# EAGLE design StepperDriver_RevA (EAGLE 7.6.0)
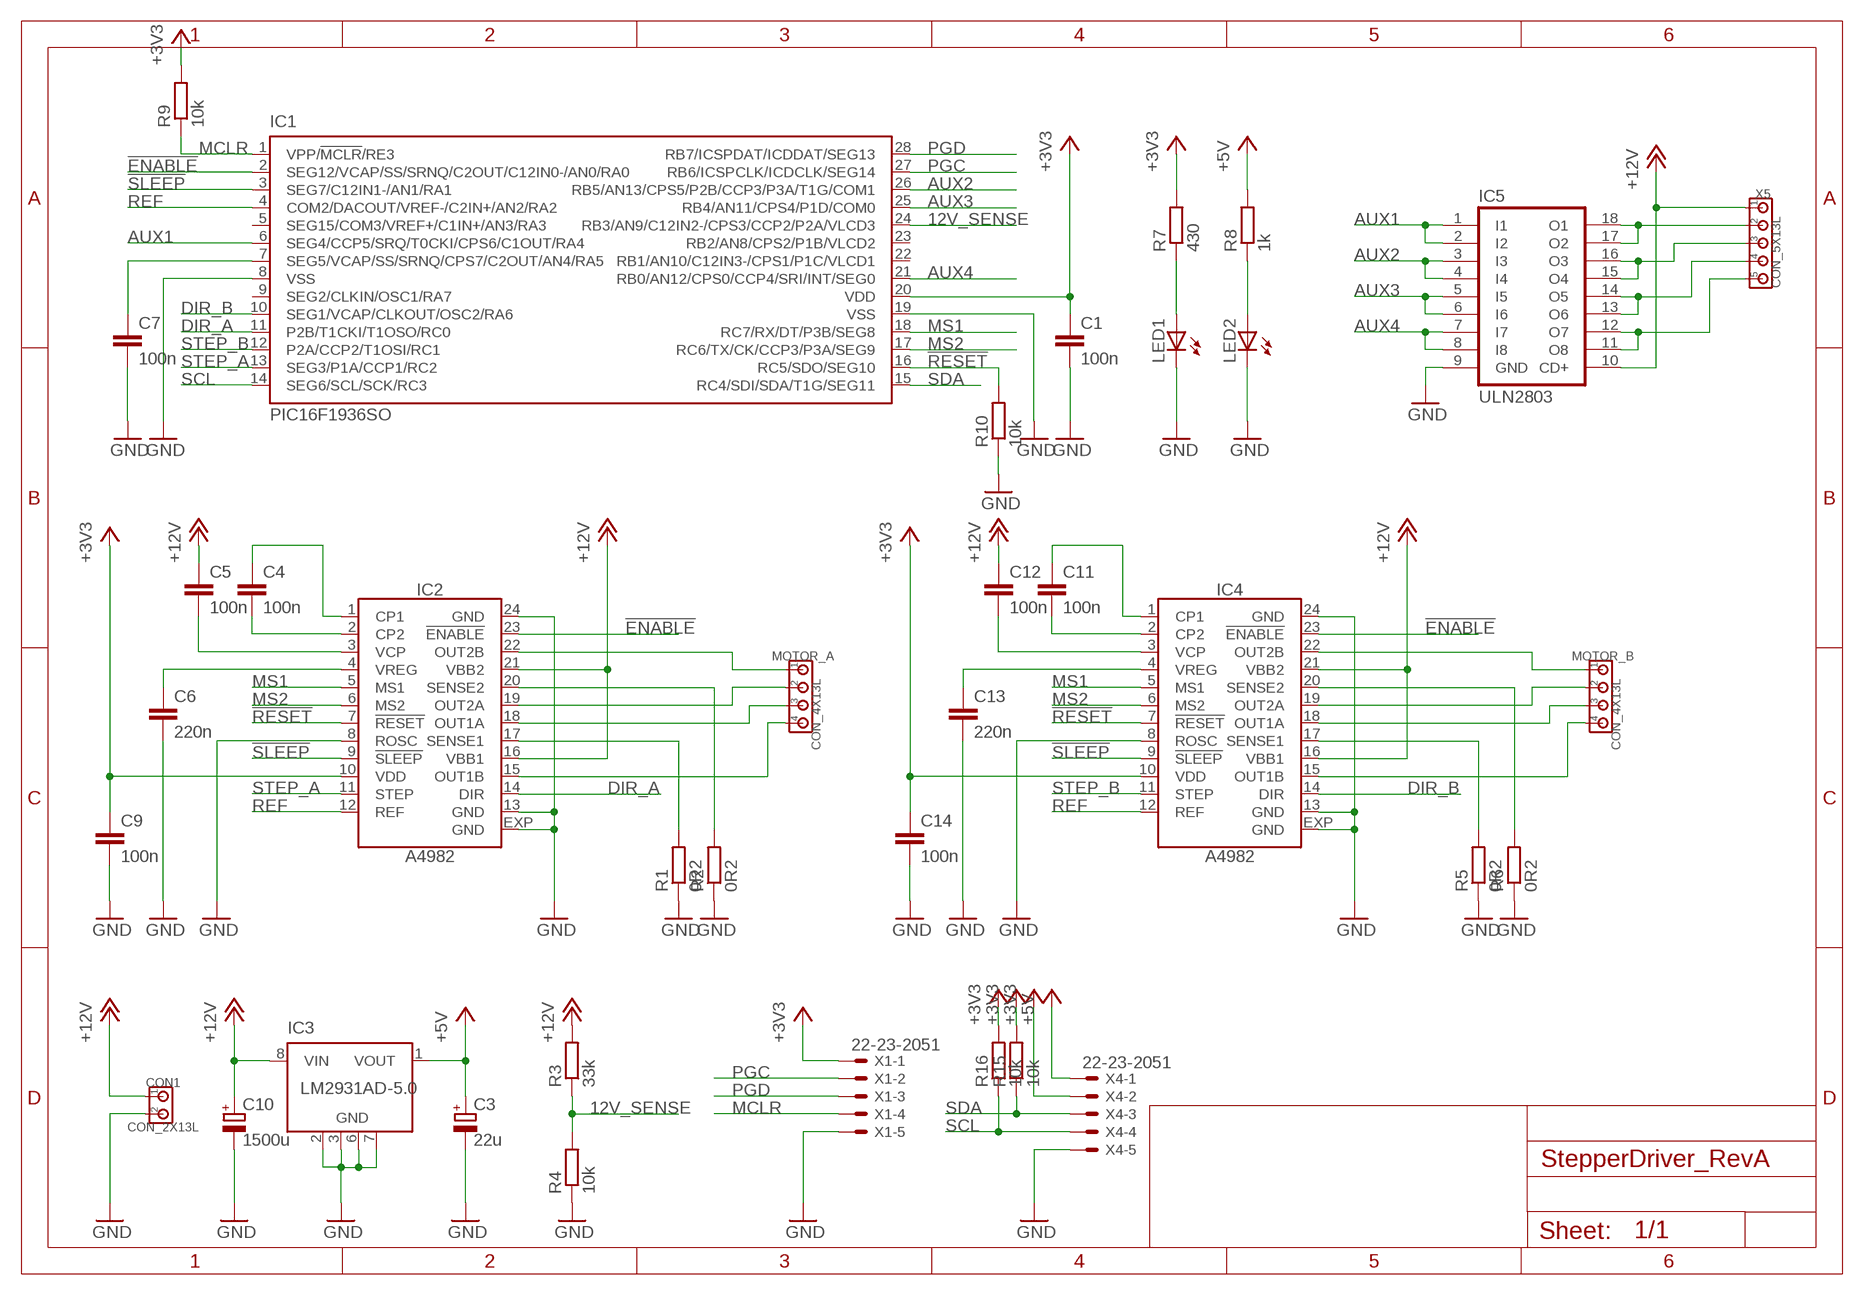
[diagram p0: schematic, sheet 1]

## Parts
C1  100n  CC0805  [C0805]
C3  22u  C_POLARIZEDSMC_C  [SMC_C]
C4  100n  CC0805  [C0805]
C5  100n  CC0805  [C0805]
C6  220n  CC0805  [C0805]
C7  100n  CC0805  [C0805]
C9  100n  CC0805  [C0805]
C10  1500u  C_POLARIZED10MM  [10MM]
C11  100n  CC0805  [C0805]
C12  100n  CC0805  [C0805]
C13  220n  CC0805  [C0805]
C14  100n  CC0805  [C0805]
CON1  CON_2X13L  [200MIL_2X]
IC1  PIC16F1936SO  [SO28W]
IC2  A4982  [TSSOP-24_LP]
IC3  LM2931AD-5.0  [SO8]
IC4  A4982  [TSSOP-24_LP]
IC5  ULN2803  [SO18W]
LED1  LED0805  [LED0805]
LED2  LED0805  [LED0805]
MOTOR_A  CON_4X13L  [200MIL_4X]
MOTOR_B  CON_4X13L  [200MIL_4X]
R1  0R2  RESISTOR0612  [0612]
R2  0R2  RESISTOR0612  [0612]
R3  33k  RESISTORR0805  [R0805]
R4  10k  RESISTORR0805  [R0805]
R5  0R2  RESISTOR0612  [0612]
R6  0R2  RESISTOR0612  [0612]
R7  430  RESISTORR0805  [R0805]
R8  1k  RESISTORR0805  [R0805]
R9  10k  RESISTORR0805  [R0805]
R10  10k  RESISTORR0805  [R0805]
R15  10k  RESISTORR0805  [R0805]
R16  10k  RESISTORR0805  [R0805]
X1  22-23-2051  [22-23-2051]
X4  22-23-2051  [22-23-2051]
X5  CON_5X13L  [200MIL_5X]

## Nets
12V_SENSE: IC1.24(RB3/AN9/C12IN2-/CPS3/CCP2/P2A/VLCD3) R3.1 R4.2
!ENABLE!: IC1.2(SEG12/VCAP/SS/SRNQ/C2OUT/C12IN0-/AN0/RA0) IC2.23(!ENABLE!) IC4.23(!ENABLE!)
!RESET!: IC1.16(RC5/SDO/SEG10) IC2.7(!RESET!) IC4.7(!RESET!) R10.2
!SLEEP!: IC1.3(SEG7/C12IN1-/AN1/RA1) IC2.9(!SLEEP!) IC4.9(!SLEEP!)
+3V3: C1.1 C9.1 C14.1 IC1.20(VDD) IC2.10(VDD) IC4.10(VDD) R7.2 R9.2 R15.2 R16.2 X1.1 X4.2
+5V: C3.+ IC3.1(VOUT) R8.2 X4.1
+12V: C5.1 C10.+ C12.1 CON1.1 IC2.16(VBB1) IC2.21(VBB2) IC3.8(VIN) IC4.16(VBB1) IC4.21(VBB2) IC5.10(CD+) R3.2 X5.1
AUX1: IC1.6(SEG4/CCP5/SRQ/T0CKI/CPS6/C1OUT/RA4) IC5.1(I1) IC5.2(I2)
AUX2: IC1.26(RB5/AN13/CPS5/P2B/CCP3/P3A/T1G/COM1) IC5.3(I3) IC5.4(I4)
AUX3: IC1.25(RB4/AN11/CPS4/P1D/COM0) IC5.5(I5) IC5.6(I6)
AUX4: IC1.21(RB0/AN12/CPS0/CCP4/SRI/INT/SEG0) IC5.7(I7) IC5.8(I8)
DIR_A: IC1.11(P2B/T1CKI/T1OSO/RC0) IC2.14(DIR)
DIR_B: IC1.10(SEG1/VCAP/CLKOUT/OSC2/RA6) IC4.14(DIR)
GND: C1.2 C3.- C6.2 C7.2 C9.2 C10.- C13.2 C14.2 CON1.2 IC1.8(VSS) IC1.19(VSS) IC2.8(ROSC) IC2.13(GND) IC2.24(GND) IC2.EXP(GND) IC3.2(GND) IC3.3(GND) IC3.6(GND) IC3.7(GND) IC4.8(ROSC) IC4.13(GND) IC4.24(GND) IC4.EXP(GND) IC5.9(GND) LED1.C LED2.C R1.1 R2.1 R4.1 R5.1 R6.1 R10.1 X1.5 X4.5
MCLR: IC1.1(VPP/!MCLR!/RE3) R9.1 X1.4
MS1: IC1.18(RC7/RX/DT/P3B/SEG8) IC2.5(MS1) IC4.5(MS1)
MS2: IC1.17(RC6/TX/CK/CCP3/P3A/SEG9) IC2.6(MS2) IC4.6(MS2)
N$1: LED1.A R7.1
N$2: LED2.A R8.1
N$5: C7.1 IC1.7(SEG5/VCAP/SS/SRNQ/CPS7/C2OUT/AN4/RA5)
N$6: IC2.22(OUT2B) MOTOR_A.1
N$11: IC2.19(OUT2A) MOTOR_A.2
N$13: IC2.18(OUT1A) MOTOR_A.3
N$14: C4.2 IC2.2(CP2)
N$15: IC2.15(OUT1B) MOTOR_A.4
N$16: C4.1 IC2.1(CP1)
N$17: C5.2 IC2.3(VCP)
N$18: C6.1 IC2.4(VREG)
N$22: IC2.20(SENSE2) R2.2
N$23: IC2.17(SENSE1) R1.2
N$24: IC4.22(OUT2B) MOTOR_B.1
N$25: IC4.19(OUT2A) MOTOR_B.2
N$26: IC4.18(OUT1A) MOTOR_B.3
N$27: IC4.15(OUT1B) MOTOR_B.4
N$28: C11.2 IC4.2(CP2)
N$29: C11.1 IC4.1(CP1)
N$30: C12.2 IC4.3(VCP)
N$31: C13.1 IC4.4(VREG)
N$32: IC4.20(SENSE2) R6.2
N$33: IC4.17(SENSE1) R5.2
N$34: IC5.17(O2) IC5.18(O1) X5.2
N$35: IC5.15(O4) IC5.16(O3) X5.3
N$36: IC5.13(O6) IC5.14(O5) X5.4
N$37: IC5.11(O8) IC5.12(O7) X5.5
PGC: IC1.27(RB6/ICSPCLK/ICDCLK/SEG14) X1.2
PGD: IC1.28(RB7/ICSPDAT/ICDDAT/SEG13) X1.3
REF: IC1.4(COM2/DACOUT/VREF-/C2IN+/AN2/RA2) IC2.12(REF) IC4.12(REF)
SCL: IC1.14(SEG6/SCL/SCK/RC3) R16.1 X4.4
SDA: IC1.15(RC4/SDI/SDA/T1G/SEG11) R15.1 X4.3
STEP_A: IC1.13(SEG3/P1A/CCP1/RC2) IC2.11(STEP)
STEP_B: IC1.12(P2A/CCP2/T1OSI/RC1) IC4.11(STEP)
Unconnected: IC1.5(SEG15/COM3/VREF+/C1IN+/AN3/RA3) IC1.9(SEG2/CLKIN/OSC1/RA7) IC1.22(RB1/AN10/C12IN3-/CPS1/P1C/VLCD1) IC1.23(RB2/AN8/CPS2/P1B/VLCD2)

## Library data of the parts
C1 C4-C7 C9 C11-C14 = 00Capacitor:C: Capacitor
C3 C10 = 00Capacitor:C_POLARIZED
CON1 = 00Connector:CON_2X: 2-pin header
IC1 = 00PIC:PIC16F19*: Flash-Based, 8-Bit CMOS Microcontroller; EEPROM: 256; FLASH: 8192; RAM: 512
IC2 IC4 = 00Logic:A4982
IC3 = 00VoltageRegulator:LM2931*
IC5 = 00Mosfet:ULN2803
LED1 LED2 = 00Display:LED: LED
MOTOR_A MOTOR_B = 00Connector:CON_4X: 4-pin header
R1-R10 R15 R16 = 00Resistor:RESISTOR: RESISTOR, European symbol
X1 X4 = 00Connector:22-23-2051: .100" (2.54mm) Center Header - 5 Pin; MF: MOLEX; MPN: 22-23-2051; OC_FARNELL: 1462952; OC_NEWARK: 38C9178
X5 = 00Connector:CON_5X: 5-pin header

## Board
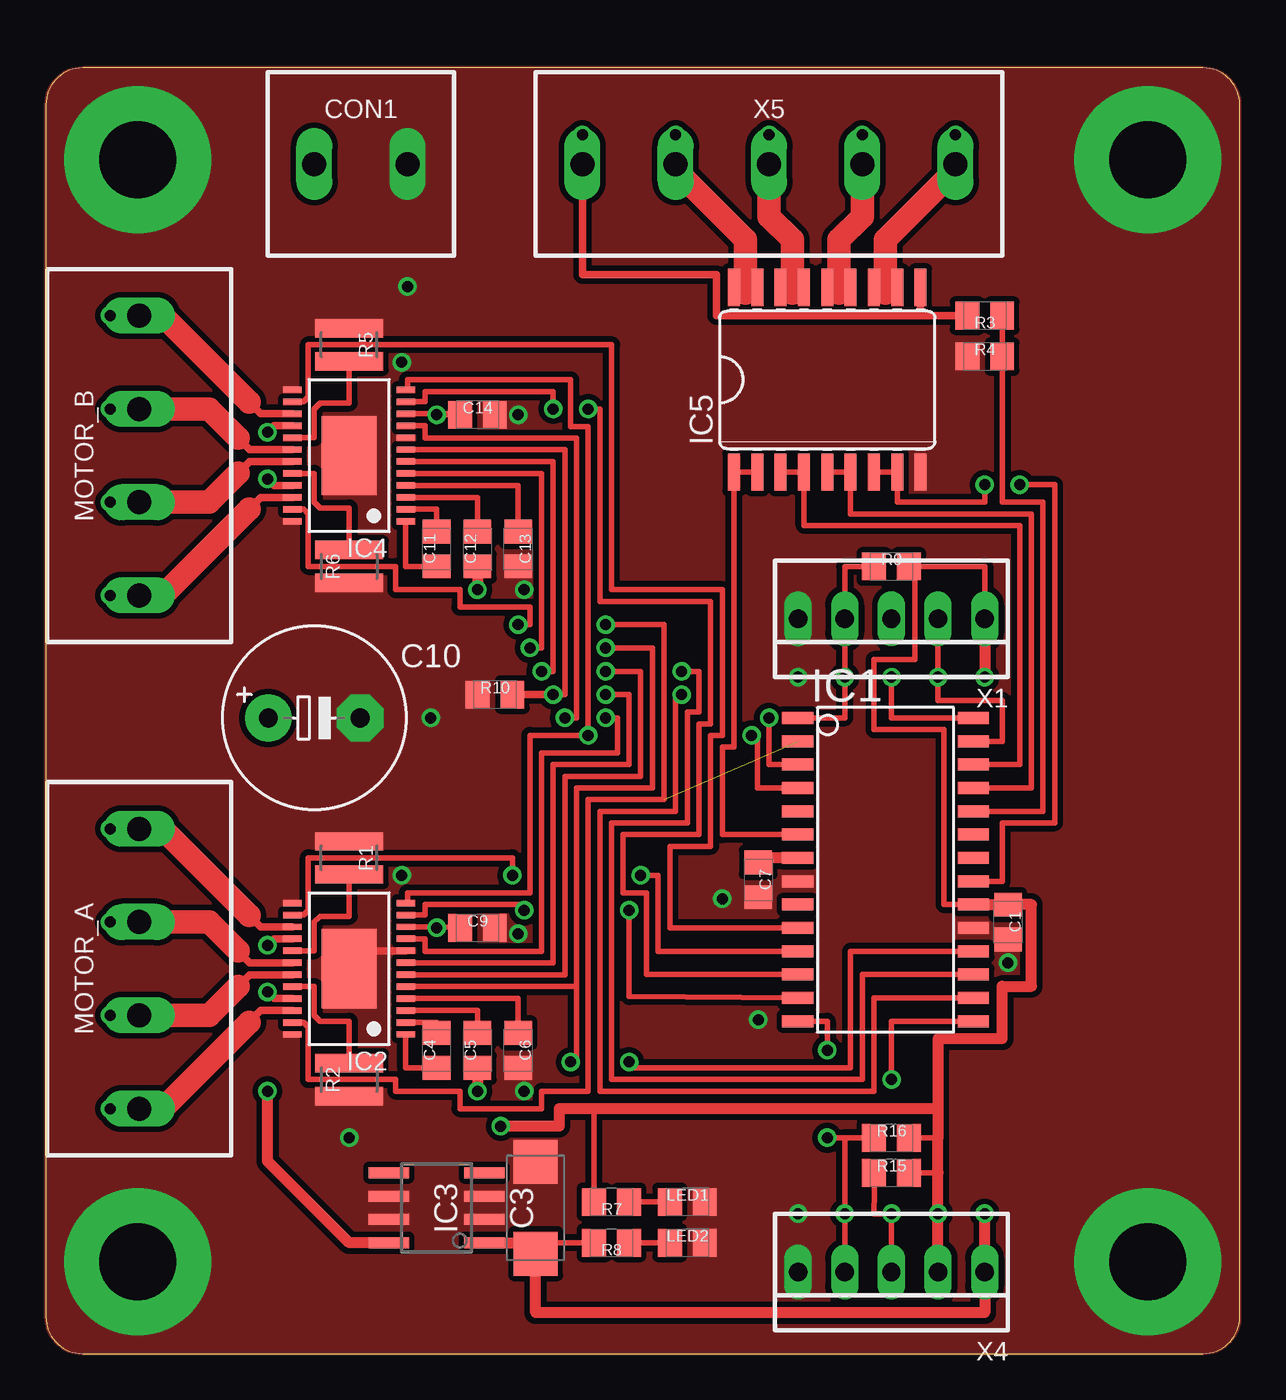
[diagram p1: board, top side]
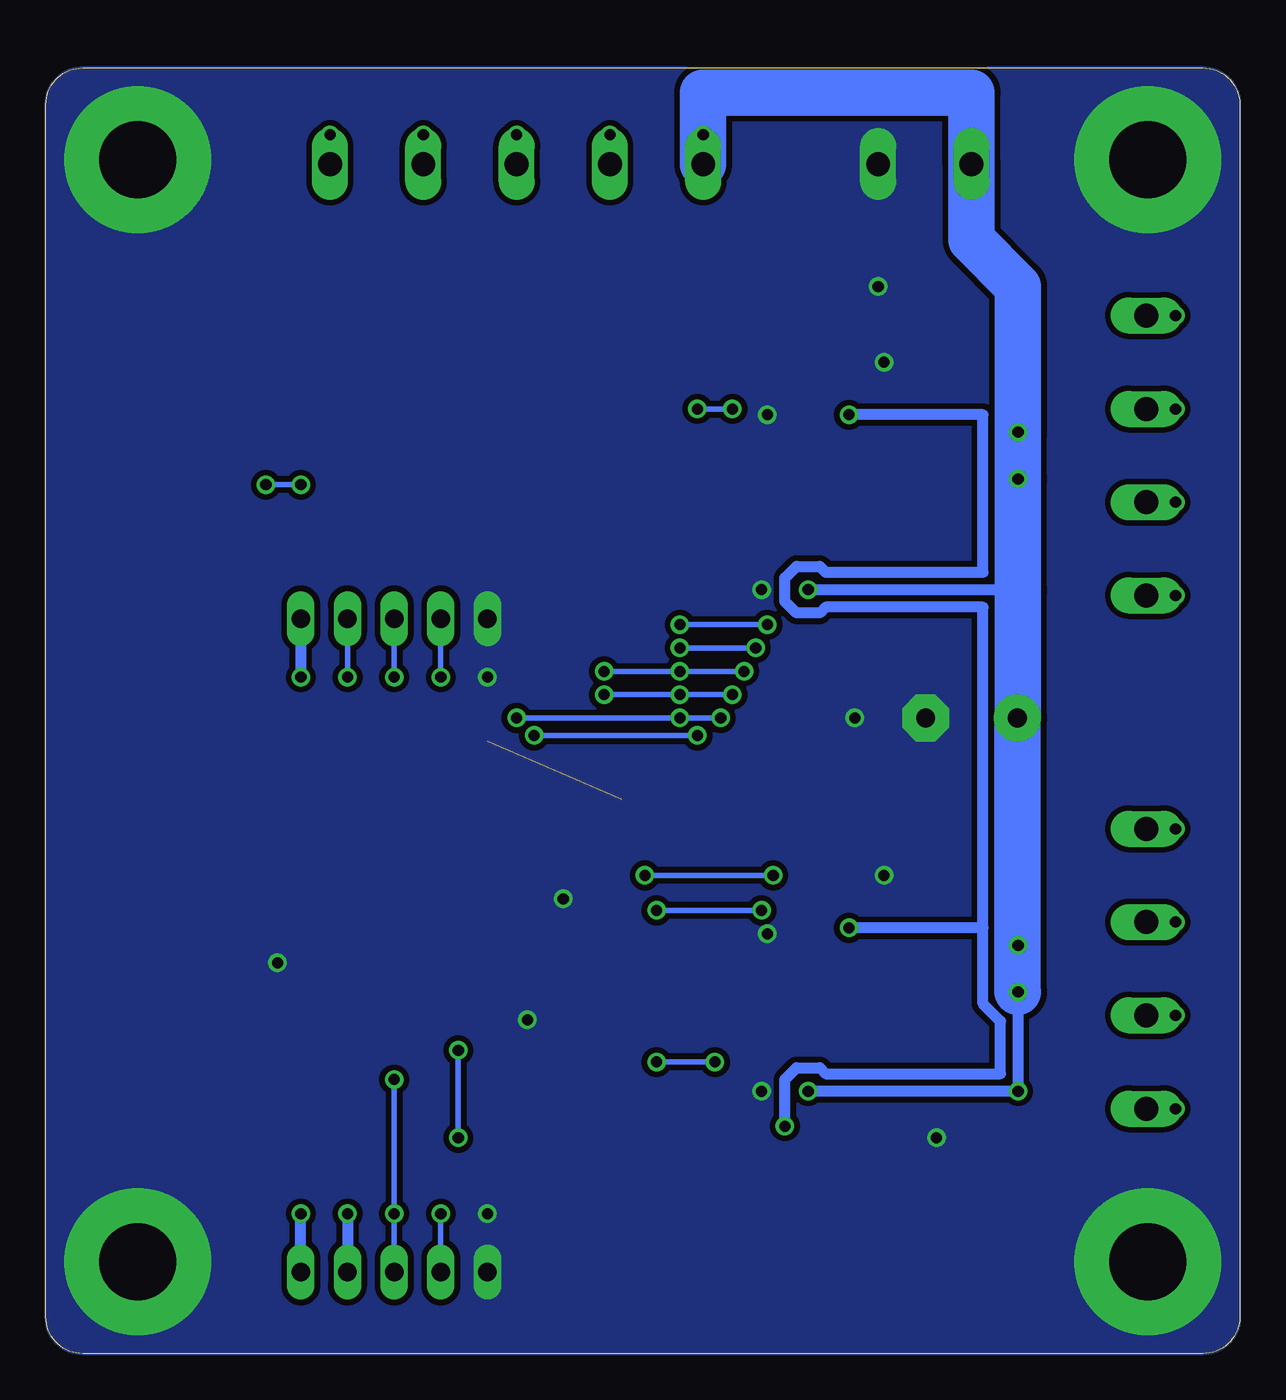
[diagram p2: board, bottom side, seen from below]

Size 65 x 70 mm. Coordinates in mm from the lower left corner, seen from the top.
Outline: 63,0 arc90 65,2 65,68 arc90 63,70 2,70 arc90 0,68 0,2 arc90 2,0 63,0
Copper layers (1*16): Top 0.035mm / dielectric 1.5mm / Bottom 0.035mm
Design rules "default *": minimum track width 10mil, minimum drill 0.6mm, track to track 8mil, track to pad 8mil, pad to pad 8mil, via to via 8mil, smd to smd 8mil, copper to edge 0mil, drill to drill 8mil, minimum pad ring 10mil, minimum via ring 8mil, stop-mask expansion 4mil, vias tented up to drill 0mil, thermal gap 10mil

### Footprints (pad centres in the part's own frame; a part is rotated, then mirrored left to right if it is on the bottom)
C0805 = smd 1.3 x 1.5: 1 -0.95,0; 2 0.95,0
SMC_C = smd 2.4 x 2.4: + -2.5,0; - 2.5,0
10MM = drill 1.016 pad 2.54: + -2.5,0 | drill 1.016 pad 2.54 octagon: - 2.5,0
200MIL_2X = drill 1.3 long: 1 -2.54,0; 2 2.54,0
SO28W = smd 0.65 x 1.7: 1 -7.62,-4.78; 2 -6.35,-4.78; 3 -5.08,-4.78; 4 -3.81,-4.78; 5 -2.54,-4.78; 6 -1.27,-4.78; 7 0,-4.78; 8 1.27,-4.78; 9 2.54,-4.78; 10 3.81,-4.78; 11 5.08,-4.78; 12 6.35,-4.78; 13 7.62,-4.78; 14 8.89,-4.78; 15 8.89,4.78; 16 7.62,4.78; 17 6.35,4.78; 18 5.08,4.78; 19 3.81,4.78; 20 2.54,4.78; 21 1.27,4.78; 22 0,4.78; 23 -1.27,4.78; 24 -2.54,4.78; 25 -3.81,4.78; 26 -5.08,4.78; 27 -6.35,4.78; 28 -7.62,4.78
TSSOP-24_LP = smd 0.35 x 1: 1 -3.575,-3.087; 2 -2.925,-3.087; 3 -2.275,-3.087; 4 -1.625,-3.087; 5 -0.975,-3.087; 6 -0.325,-3.087; 7 0.325,-3.087; 8 0.975,-3.087; 9 1.625,-3.087; 10 2.275,-3.087; 11 2.925,-3.087; 12 3.575,-3.087; 13 3.575,3.087; 14 2.925,3.087; 15 2.275,3.087; 16 1.625,3.087; 17 0.975,3.087; 18 0.325,3.087; 19 -0.325,3.087; 20 -0.975,3.087; 21 -1.625,3.087; 22 -2.275,3.087; 23 -2.925,3.087; 24 -3.575,3.087 | smd 4.32 x 3: EXP 0,0
SO8 = smd 2.2 x 0.6: 1 -2.6,1.905; 2 -2.6,0.635; 3 -2.6,-0.635; 4 -2.6,-1.905; 5 2.6,-1.905; 6 2.6,-0.635; 7 2.6,0.635; 8 2.6,1.905
SO18W = smd 0.66 x 2.032: 1 -5.08,-5.029; 2 -3.81,-5.029; 3 -2.54,-5.029; 4 -1.27,-5.029; 5 0,-5.029; 6 1.27,-5.029; 7 2.54,-5.029; 8 3.81,-5.029; 9 5.08,-5.029; 10 5.08,5.029; 11 3.81,5.029; 12 2.54,5.029; 13 1.27,5.029; 14 0,5.029; 15 -1.27,5.029; 16 -2.54,5.029; 17 -3.81,5.029; 18 -5.08,5.029
LED0805 = smd 1.3 x 1.5: A -0.95,0; C 0.95,0
200MIL_4X = drill 1.3 long: 1 -7.62,0; 2 -2.54,0; 3 2.54,0; 4 7.62,0
0612 = smd 1 x 3.7: 1 -0.9,0; 2 0.9,0
R0805 = smd 1.3 x 1.5: 1 -0.95,0; 2 0.95,0
22-23-2051 = drill 1 long: 1 -5.08,0; 2 -2.54,0; 3 0,0; 4 2.54,0; 5 5.08,0
200MIL_5X = drill 1.3 long: 1 -10.16,0; 2 -5.08,0; 3 0,0; 4 5.08,0; 5 10.16,0

### Placement (x,y rotation side)
C1  52.39,23.5 270 top
C3  26.67,7.94 90 top
C4  21.27,16.51 90 top
C5  23.5,16.51 90 top
C6  25.72,16.51 270 top
C7  38.78,25.8 270 top
C9  23.5,23.18 0 top
C10  14.61,34.61 0 top
C11  21.27,43.81 90 top
C12  23.5,43.81 90 top
C13  25.72,43.81 270 top
C14  23.5,51.12 0 top
CON1  17.14,64.77 0 top
IC1  45.72,26.99 270 top
IC2  16.51,20.95 90 top
IC3  21.27,7.94 180 top
IC4  16.51,48.9 90 top
IC5  42.55,53.02 0 top
LED1  34.92,8.26 0 top
LED2  34.92,6.03 0 top
MOTOR_A  5.08,20.95 90 top
MOTOR_B  5.08,48.9 90 top
R1  16.51,26.99 270 top
R2  16.51,14.92 90 top
R3  51.12,56.52 180 top
R4  51.12,54.29 0 top
R5  16.51,54.93 270 top
R6  16.51,42.86 90 top
R7  30.8,8.26 180 top
R8  30.8,6.03 180 top
R9  46.04,42.86 0 top
R10  24.45,35.88 0 top
R15  46.04,9.84 0 top
R16  46.04,11.75 0 top
X1  46.04,40.01 180 top
X4  46.04,4.45 180 top
X5  39.37,64.77 0 top

### Tracks (layer width: path | path; a pad name or v marks a point on that pad's centre or on a via)
12V_SENSE
  Top 0.305: R3.1 R4.2 52.07,46.35 54.29,46.35 54.29,29.53 IC1.24
!ENABLE!  (via drill 0.6)  (1 unrouted)
  Top 0.305: IC2.23 14.04,18.03 14.29,17.78 14.29,14.92 19.05,14.92 19.05,14.29 22.54,14.29 22.54,13.34 26.99,13.34 26.99,14.29 29.53,14.29 29.53,30.16 33.66,30.16 33.66,39.69 v30.48,39.69 | IC4.23 14.04,45.97 14.29,45.72 14.29,42.86 19.05,42.86 19.05,41.59 22.54,41.59 22.54,40.64 26.35,40.64 26.35,39.69 v25.72,39.69
  Bottom 0.305: v30.48,39.69 v25.72,39.69
!RESET!  (via drill 0.6)
  Top 0.305: IC4.7 28.26,49.22 28.26,35.88 v27.62,35.88 | v30.48,35.88 31.75,35.88 31.75,32.07 27.62,32.07 27.62,21.27 IC2.7 | IC1.16 45.09,19.37 45.09,14.29 30.16,14.29 30.16,29.53 34.29,29.53 34.29,35.88 v34.61,35.88
  Top 0.406: R10.2 v27.62,35.88
  Bottom 0.305: v27.62,35.88 v30.48,35.88 v34.61,35.88
!SLEEP!  (via drill 0.6)
  Top 0.305: IC2.9 20.64,22.58 20.64,21.91 26.99,21.91 26.99,32.7 31.11,32.7 31.11,34.61 v30.48,34.61 | IC4.9 20.64,50.52 20.64,49.85 28.89,49.85 28.89,34.61 v28.26,34.61 | IC1.3 39.37,32.07 v39.37,34.61
  Bottom 0.305: v28.26,34.61 v30.48,34.61 v39.37,34.61
+3V3  (via drill 0.6)
  Top 0.305: R16.2 48.58,11.75 | R15.2 48.58,9.84 | IC2.10 21.27,23.23 | 21.27,23.23 21.59,23.23 C9.1 | v21.27,23.18 21.27,23.23 | IC4.10 22.55,51.17 C14.1 v21.27,51.12 | X1.1 51.12,42.86 R9.2 47.31,42.86 47.31,37.78 45.09,37.78 45.09,33.97 48.9,33.97 48.9,24.45 IC1.20 | R7.2 29.84,13.34
  Top 0.61: 50.48,24.45 IC1.20 C1.1 | X4.2 v48.58,7.62 48.58,9.84 48.58,11.75 48.58,13.34 | X1.1 v51.12,36.83 | 48.58,13.34 48.58,17.14 52.07,17.14 52.07,20 53.66,20 53.66,24.45 C1.1 | C1.1 | 48.58,13.34 29.84,13.34 27.94,13.34 27.94,12.38 v24.77,12.38
  Bottom 0.61: X1.1 v51.12,36.83 | v48.58,7.62 X4.2 | v24.77,12.38 24.77,14.92 24.13,15.56 22.86,15.56 22.54,15.24 13.02,15.24 13.02,18.1 13.97,19.05 13.97,23.18 | 13.97,23.18 v21.27,23.18 | 13.97,23.18 13.97,40.64 22.54,40.64 22.86,40.32 24.13,40.32 24.77,40.96 24.77,42.23 24.13,42.86 22.86,42.86 22.54,42.55 13.97,42.55 13.97,51.12 v21.27,51.12
+5V  (via drill 0.6)
  Top 0.305: R8.2 26.67,6.03 C3.+
  Top 0.61: IC3.1 26.35,6.03 C3.+ 26.67,2.22 51.12,2.22 X4.1 v51.12,7.62
  Bottom 0.61: X4.1 v51.12,7.62
+12V  (via drill 0.6)
  Top 0.406: IC2.16 12.42,22.58 v12.06,22.23 | IC2.21 12.42,19.33 v12.06,19.68 | IC4.16 12.42,50.52 v12.06,50.16 | IC4.21 12.42,47.27 v12.06,47.62 | IC5.10 47.62,56.52 | 47.62,56.52 36.51,56.52 36.51,58.74 29.21,58.74 v29.21,66.36 X5.1 | 47.62,56.52 R3.2
  Top 0.61: C5.1 v23.5,14.29 | IC3.8 16.51,6.03 12.06,10.48 v12.06,14.29 | C12.1 v23.5,41.59
  Bottom 0.406: v12.06,22.23 v12.06,19.68 12.06,19.64
  Bottom 0.61: X5.1 v29.21,66.36 | v12.06,19.68 v12.06,14.29 v23.5,14.29 | v23.5,41.59 12.06,41.59 | C10.+ 12.06,34.61
  Bottom 2.54: 12.06,34.61 12.06,41.59 v12.06,47.62 v12.06,50.16 12.06,58.1 14.61,60.64 CON1.1 14.61,68.66 29.21,68.66 X5.1 | C10.+ 12.11,19.73 v12.06,19.68
AUX1
  Top 0.305: IC5.2 IC5.1 37.47,33.02 36.83,33.02 36.83,28.26 IC1.6
AUX2
  Top 0.305: IC5.3 IC5.4 41.27,45.09 53.02,45.09 53.02,32.07 IC1.26
AUX3
  Top 0.305: IC5.5 IC5.6 43.81,45.72 53.66,45.72 53.66,30.8 IC1.25
AUX4  (via drill 0.6)
  Top 0.305: IC5.7 IC5.8 46.35,46.35 51.12,46.35 v51.12,47.31 | v53.02,47.31 54.93,47.31 54.93,28.89 52.07,28.89 52.07,25.72 IC1.21
  Bottom 0.305: v51.12,47.31 v53.02,47.31
DIR_A  (via drill 0.6)
  Top 0.305: IC2.14 14.04,23.88 14.29,24.13 14.29,26.99 25.4,26.99 v25.4,26.04 | IC1.11 33.34,21.91 33.34,26.04 v32.38,26.04
  Bottom 0.305: v25.4,26.04 v32.38,26.04
DIR_B
  Top 0.305: IC4.14 14.04,51.82 14.29,52.07 14.29,54.93 30.8,54.93 30.8,41.59 36.83,41.59 36.83,33.66 36.2,33.66 36.2,27.62 33.97,27.62 33.97,23.18 IC1.10
GND  (via drill 0.6, 4.2 pad 8)
  Top 0.406: IC2.8 16.51,21.93 IC2.EXP
  other vias: 5,5 60,5 5,65 60,65 40.96,36.83 38.78,18.18 26.04,14.29 19.37,26.04 25.72,22.86 52.39,21.27 36.83,24.77 26.04,41.59 19.37,53.98 25.72,51.12 16.51,11.75 40.96,7.62 19.68,58.1 20.95,34.61
  pour Bottom (isolate 0.305, no thermals): 63,0 2,0 arc-90 0,2 0,68 arc-90 2,70 63,70 arc-90 65,68 65,2 arc-90
  pour Top (isolate 0.305, no thermals): 0,2 0,68 arc-90 2,70 63,70 arc-90 65,68 65,2 arc-90 63,0 2,0 arc-90
MCLR  (via drill 0.6)
  Top 0.305: IC1.1 43.5,34.61 v43.5,36.83 X1.4 43.5,42.86 R9.1
  Bottom 0.305: X1.4 v43.5,36.83
MS1  (via drill 0.6)
  Top 0.305: IC4.5 26.99,47.92 26.99,38.42 v26.35,38.42 | 28.89,19.98 28.89,15.88 v28.57,15.88 | 28.89,19.98 28.89,30.8 33.02,30.8 33.02,38.42 v30.48,38.42 | IC1.18 43.81,21.91 43.81,15.56 31.75,15.56 v31.75,15.88 | IC2.5 28.89,19.98
  Bottom 0.305: v30.48,38.42 v26.35,38.42 | v28.57,15.88 v31.75,15.88
MS2  (via drill 0.6)
  Top 0.305: IC4.6 27.62,48.57 27.62,37.15 v26.99,37.15 | v30.48,37.15 32.38,37.15 32.38,31.43 28.26,31.43 28.26,20.63 IC2.6 | IC1.17 44.45,20.64 44.45,14.92 30.8,14.92 30.8,28.89 34.92,28.89 34.92,34.92 35.56,34.92 35.56,37.15 v34.61,37.15
  Bottom 0.305: v26.99,37.15 v30.48,37.15 v34.61,37.15
N$1
  Top 0.305: R7.1 LED1.A
N$2
  Top 0.305: R8.1 LED2.A
N$5
  Top 0.61: IC1.7 38.78,26.99 C7.1
N$6  (via drill 0.6)
  Top 0.406: IC2.22 11.7,18.68 11.06,18.05
  Top 0.61: v3.49,13.34 MOTOR_A.1
  Top 1.27: 11.06,18.05 6.35,13.34 MOTOR_A.1
N$11  (via drill 0.6)
  Top 0.406: IC2.19 11.11,20.63 10.47,20
  Top 0.61: v3.49,18.41 MOTOR_A.2
  Top 1.27: 10.47,20 8.89,18.41 MOTOR_A.2
N$13  (via drill 0.6)
  Top 0.406: IC2.18 11.11,21.28 10.47,21.91
  Top 0.61: v3.49,23.5 MOTOR_A.3
  Top 1.27: 10.47,21.91 8.89,23.5 MOTOR_A.3
N$14
  Top 0.305: IC2.2 21.27,18.03 C4.2
N$15  (via drill 0.6)
  Top 0.406: IC2.15 11.7,23.23 11.06,23.86
  Top 0.61: v3.49,28.57 MOTOR_A.4
  Top 1.27: 11.06,23.86 6.35,28.57 MOTOR_A.4
N$16
  Top 0.305: C4.1 19.6,15.56 IC2.1
N$17
  Top 0.305: IC2.3 23.5,18.68 C5.2
N$18
  Top 0.305: IC2.4 25.72,19.33 C6.1
N$22
  Top 0.305: IC2.20 14.61,19.98 14.61,18.41 14.92,18.1 16.51,18.1 R2.2
N$23
  Top 0.305: IC2.17 14.61,21.93 14.61,23.5 14.92,23.81 16.51,23.81 R1.2
N$24  (via drill 0.6)
  Top 0.406: IC4.22 11.7,46.62 11.06,45.98
  Top 0.61: MOTOR_B.1 v3.49,41.27
  Top 1.27: 11.06,45.98 6.35,41.27 MOTOR_B.1
N$25  (via drill 0.6)
  Top 0.406: IC4.19 11.11,48.57 10.47,47.94
  Top 0.61: MOTOR_B.2 v3.49,46.35
  Top 1.27: 10.47,47.94 8.89,46.35 MOTOR_B.2
N$26  (via drill 0.6)
  Top 0.406: IC4.18 11.11,49.22 10.47,49.85
  Top 0.61: MOTOR_B.3 v3.49,51.44
  Top 1.27: 10.47,49.85 8.89,51.44 MOTOR_B.3
N$27  (via drill 0.6)
  Top 0.406: IC4.15 11.7,51.17 11.06,51.8
  Top 0.61: MOTOR_B.4 v3.49,56.52
  Top 1.27: 11.06,51.8 6.35,56.52 MOTOR_B.4
N$28
  Top 0.305: IC4.2 21.27,45.97 C11.2
N$29
  Top 0.305: C11.1 19.6,42.87 IC4.1
N$30
  Top 0.305: IC4.3 23.5,46.62 C12.2
N$31
  Top 0.305: IC4.4 25.72,47.27 C13.1
N$32
  Top 0.305: IC4.20 14.61,47.92 14.61,46.35 14.92,46.04 16.51,46.04 R6.2
N$33
  Top 0.305: IC4.17 14.61,49.87 14.61,51.44 14.92,51.75 16.51,51.75 R5.2
N$34  (via drill 0.6)
  Top 0.406: IC5.17 38.1,57.73 IC5.18
  Top 0.61: v34.29,66.36 X5.2
  Top 1.27: X5.2 34.29,64.45 38.1,60.64 38.1,57.73
N$35  (via drill 0.6)
  Top 0.406: IC5.15 40.64,57.73 IC5.16
  Top 0.61: v39.37,66.36 X5.3
  Top 1.27: X5.3 39.37,61.91 40.64,60.64 40.64,57.73
N$36  (via drill 0.6)
  Top 0.406: IC5.13 43.18,57.73 IC5.14
  Top 0.61: v44.45,66.36 X5.4
  Top 1.27: X5.4 44.45,61.91 43.18,60.64 43.18,57.73
N$37  (via drill 0.6)
  Top 0.406: IC5.11 45.72,57.73 IC5.12
  Top 0.61: v49.53,66.36 X5.5
  Top 1.27: X5.5 49.53,64.45 45.72,60.64 45.72,57.73
PGC  (via drill 0.6)
  Top 0.305: X1.2 v48.58,36.83 48.58,35.56 52.07,35.56 52.07,33.34 IC1.27
  Bottom 0.305: X1.2 v48.58,36.83
PGD  (via drill 0.6)
  Top 0.305: IC1.28 46.04,34.61 v46.04,36.83
  Bottom 0.305: X1.3 v46.04,36.83
REF  (via drill 0.6)
  Top 0.305: IC2.12 19.68,24.53 19.68,25.08 26.35,25.08 26.35,33.66 v29.53,33.66 29.53,50.48 28.57,50.48 28.57,53.02 19.68,53.02 19.68,52.47 IC4.12 | IC1.4 38.73,30.8 38.73,33.66 v38.42,33.66
  Bottom 0.305: v38.42,33.66 v29.53,33.66
SCL  (via drill 0.6)
  Top 0.305: X4.4 v43.5,7.62 43.5,11.75 | R16.1 43.5,11.75 | IC1.14 42.55,18.1 v42.55,16.51 | v42.55,11.75 43.5,11.75
  Bottom 0.305: v43.5,7.62 X4.4 | v42.55,16.51 v42.55,11.75
SDA  (via drill 0.6)
  Top 0.305: X4.3 v46.04,7.62 45.09,7.62 45.13,9.92 R15.1 | IC1.15 46.04,18.1 v46.04,14.92
  Bottom 0.305: X4.3 v46.04,7.62 v46.04,14.92
STEP_A  (via drill 0.6)
  Top 0.305: IC2.11 20.64,23.88 20.64,24.45 26.04,24.45 v26.04,24.13 | IC1.13 31.75,19.45 v31.75,24.13
  Bottom 0.305: v26.04,24.13 v31.75,24.13
STEP_B  (via drill 0.6)
  Top 0.305: IC4.11 20.64,51.82 20.64,52.39 27.62,52.39 v27.62,51.44 | IC1.12 32.7,20.64 32.7,25.08 31.43,25.08 31.43,28.26 35.56,28.26 35.56,34.29 36.2,34.29 36.2,40.96 30.16,40.96 30.16,51.44 v29.53,51.44
  Bottom 0.305: v29.53,51.44 v27.62,51.44

### Text on the board
tText: soldernerd.com